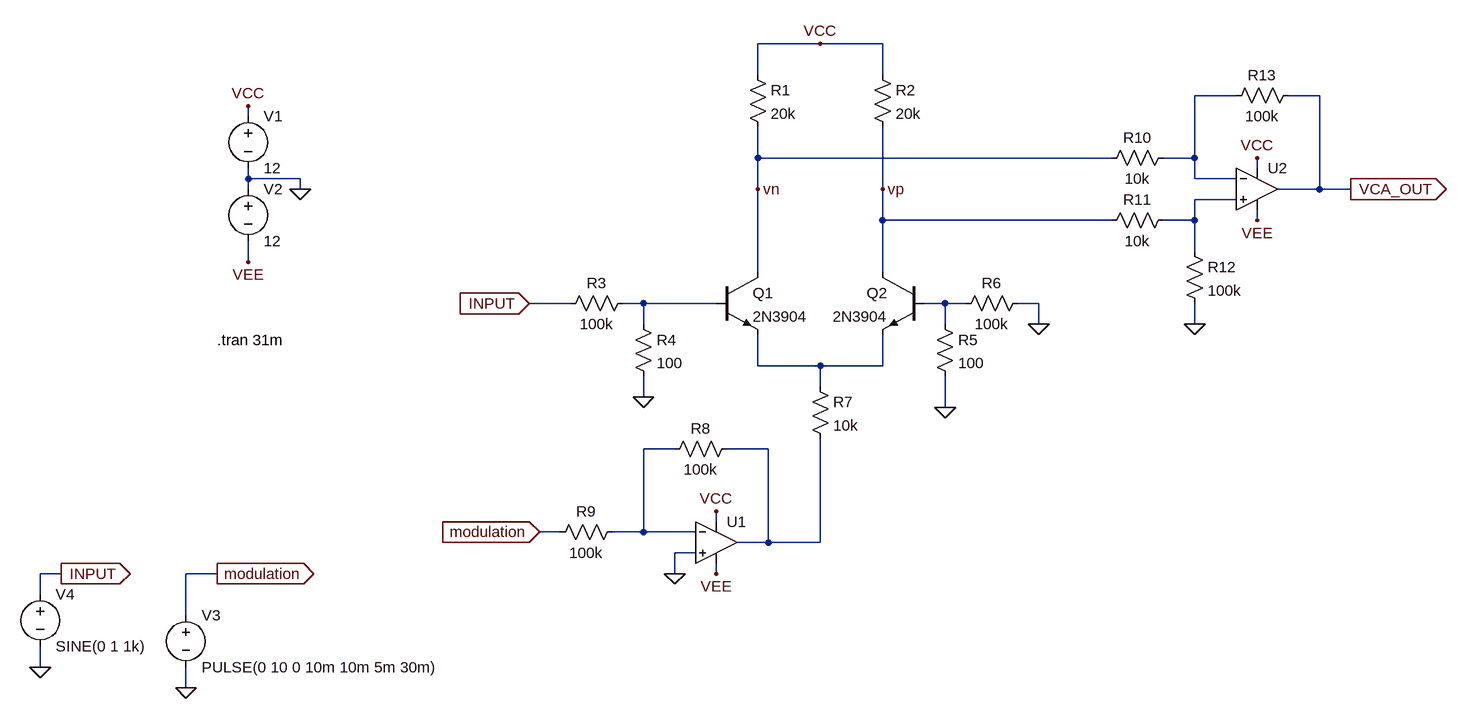
[diagram p0: schematic voltage_controlled_amplifer_vtail.asc]
voltage_controlled_amplifer_vtail.asc, the LTspice schematic file:
Version 4
SHEET 1 1288 772
WIRE 304 -240 208 -240
WIRE 400 -240 304 -240
WIRE 208 -192 208 -240
WIRE 400 -192 400 -240
WIRE 944 -160 880 -160
WIRE 1072 -160 1024 -160
WIRE -576 -128 -576 -144
WIRE 208 -64 208 -112
WIRE 752 -64 208 -64
WIRE 880 -64 880 -160
WIRE 880 -64 832 -64
WIRE 976 -48 976 -64
WIRE -576 -32 -576 -48
WIRE -496 -32 -576 -32
WIRE 880 -32 880 -64
WIRE 944 -32 880 -32
WIRE -576 -16 -576 -32
WIRE -496 -16 -496 -32
WIRE 208 -16 208 -64
WIRE 400 -16 400 -112
WIRE 1072 -16 1072 -160
WIRE 1072 -16 1008 -16
WIRE 1120 -16 1072 -16
WIRE 944 0 880 0
WIRE 400 32 400 -16
WIRE 752 32 400 32
WIRE 880 32 880 0
WIRE 880 32 832 32
WIRE 976 32 976 16
WIRE 880 80 880 32
WIRE -576 96 -576 64
WIRE 208 112 208 -16
WIRE 400 112 400 32
WIRE -80 160 -144 160
WIRE 32 160 0 160
WIRE 144 160 32 160
WIRE 496 160 464 160
WIRE 528 160 496 160
WIRE 640 160 608 160
WIRE 32 192 32 160
WIRE 496 192 496 160
WIRE 640 192 640 160
WIRE 880 192 880 160
WIRE 208 256 208 208
WIRE 304 256 208 256
WIRE 400 256 400 208
WIRE 400 256 304 256
WIRE 304 288 304 256
WIRE 32 304 32 272
WIRE 496 320 496 272
WIRE 80 384 32 384
WIRE 224 384 160 384
WIRE 144 496 144 480
WIRE -96 512 -128 512
WIRE 32 512 32 384
WIRE 32 512 -16 512
WIRE 112 512 32 512
WIRE 224 528 224 384
WIRE 224 528 176 528
WIRE 304 528 304 368
WIRE 304 528 224 528
WIRE 112 544 80 544
WIRE -864 576 -896 576
WIRE -624 576 -672 576
WIRE 80 576 80 544
WIRE 144 576 144 560
WIRE -896 608 -896 576
WIRE -672 640 -672 576
WIRE -896 720 -896 688
WIRE -672 752 -672 720
FLAG 32 304 0
FLAG 496 320 0
FLAG 640 192 0
FLAG -576 -144 VCC
FLAG -576 96 VEE
FLAG -496 -16 0
FLAG 304 -240 VCC
FLAG 80 576 0
FLAG 144 480 VCC
FLAG 144 576 VEE
FLAG -672 752 0
FLAG -896 720 0
FLAG 976 -64 VCC
FLAG 976 32 VEE
FLAG 880 192 0
FLAG 1120 -16 VCA_OUT
IOPIN 1120 -16 Out
FLAG -864 576 INPUT
IOPIN -864 576 Out
FLAG -624 576 modulation
IOPIN -624 576 Out
FLAG -144 160 INPUT
IOPIN -144 160 In
FLAG -128 512 modulation
IOPIN -128 512 In
FLAG 208 -16 vn
FLAG 400 -16 vp
SYMBOL npn 144 112 R0
SYMATTR InstName Q1
SYMATTR Value 2N3904
SYMBOL npn 464 112 M0
SYMATTR InstName Q2
SYMATTR Value 2N3904
SYMBOL res 192 -208 R0
SYMATTR InstName R1
SYMATTR Value 20k
SYMBOL res 384 -208 R0
SYMATTR InstName R2
SYMATTR Value 20k
SYMBOL res 16 144 R90
WINDOW 0 0 56 VBottom 2
WINDOW 3 32 56 VTop 2
SYMATTR InstName R3
SYMATTR Value 100k
SYMBOL res 16 176 R0
SYMATTR InstName R4
SYMATTR Value 100
SYMBOL res 480 176 R0
SYMATTR InstName R5
SYMATTR Value 100
SYMBOL res 624 144 R90
WINDOW 0 0 56 VBottom 2
WINDOW 3 32 56 VTop 2
SYMATTR InstName R6
SYMATTR Value 100k
SYMBOL res 288 272 R0
SYMATTR InstName R7
SYMATTR Value 10k
SYMBOL voltage -576 -144 R0
SYMATTR InstName V1
SYMATTR Value 12
SYMBOL voltage -576 -32 R0
SYMATTR InstName V2
SYMATTR Value 12
SYMBOL OpAmps\\UniversalOpAmp2 144 528 R0
SYMATTR InstName U1
SYMBOL res 176 368 R90
WINDOW 0 0 56 VBottom 2
WINDOW 3 32 56 VTop 2
SYMATTR InstName R8
SYMATTR Value 100k
SYMBOL res 0 496 R90
WINDOW 0 0 56 VBottom 2
WINDOW 3 32 56 VTop 2
SYMATTR InstName R9
SYMATTR Value 100k
SYMBOL voltage -672 624 R0
WINDOW 123 0 0 Left 0
WINDOW 39 0 0 Left 0
SYMATTR InstName V3
SYMATTR Value PULSE(0 10 0 10m 10m 5m 30m)
SYMBOL voltage -896 592 R0
WINDOW 123 0 0 Left 0
WINDOW 39 0 0 Left 0
SYMATTR InstName V4
SYMATTR Value SINE(0 1 1k)
SYMBOL res 848 -80 R90
WINDOW 0 0 56 VBottom 2
WINDOW 3 32 56 VTop 2
SYMATTR InstName R10
SYMATTR Value 10k
SYMBOL res 848 16 R90
WINDOW 0 0 56 VBottom 2
WINDOW 3 32 56 VTop 2
SYMATTR InstName R11
SYMATTR Value 10k
SYMBOL OpAmps\\UniversalOpAmp2 976 -16 R0
SYMATTR InstName U2
SYMBOL res 864 64 R0
SYMATTR InstName R12
SYMATTR Value 100k
SYMBOL res 1040 -176 R90
WINDOW 0 0 56 VBottom 2
WINDOW 3 32 56 VTop 2
SYMATTR InstName R13
SYMATTR Value 100k
TEXT -624 216 Left 2 !.tran 31m

The netlist it stands for:
* voltage_controlled_amplifer_vtail.asc
Q1 vn N003 N005 0 2N3904
Q2 vp N004 N005 0 2N3904
R1 VCC vn 20k
R2 VCC vp 20k
R3 N003 INPUT 100k
R4 N003 0 100
R5 N004 0 100
R6 0 N004 100k
R7 N005 N007 10k
V1 VCC 0 12
V2 0 VEE 12
XU1 0 N006 VCC VEE N007 level2 Avol=1Meg GBW=10Meg Slew=10Meg Ilimit=25m Rail=0 Vos=0 En=0 Enk=0 In=0 Ink=0 Rin=500Meg  ; pins In+ In- V+ V- OUT
R8 N007 N006 100k
R9 N006 modulation 100k
V3 modulation 0 PULSE(0 10 0 10m 10m 5m 30m)
V4 INPUT 0 SINE(0 1 1k)
R10 N001 vn 10k
R11 N002 vp 10k
XU2 N002 N001 VCC VEE VCA_OUT level2 Avol=1Meg GBW=10Meg Slew=10Meg Ilimit=25m Rail=0 Vos=0 En=0 Enk=0 In=0 Ink=0 Rin=500Meg  ; pins In+ In- V+ V- OUT
R12 N002 0 100k
R13 VCA_OUT N001 100k
.model NPN NPN
.model PNP PNP
.lib standard.bjt
.tran 31m
.lib UniversalOpAmp2.lib
.backanno
.end